# EAGLE design Custrom_Rhino_Board (EAGLE 6.5.0)
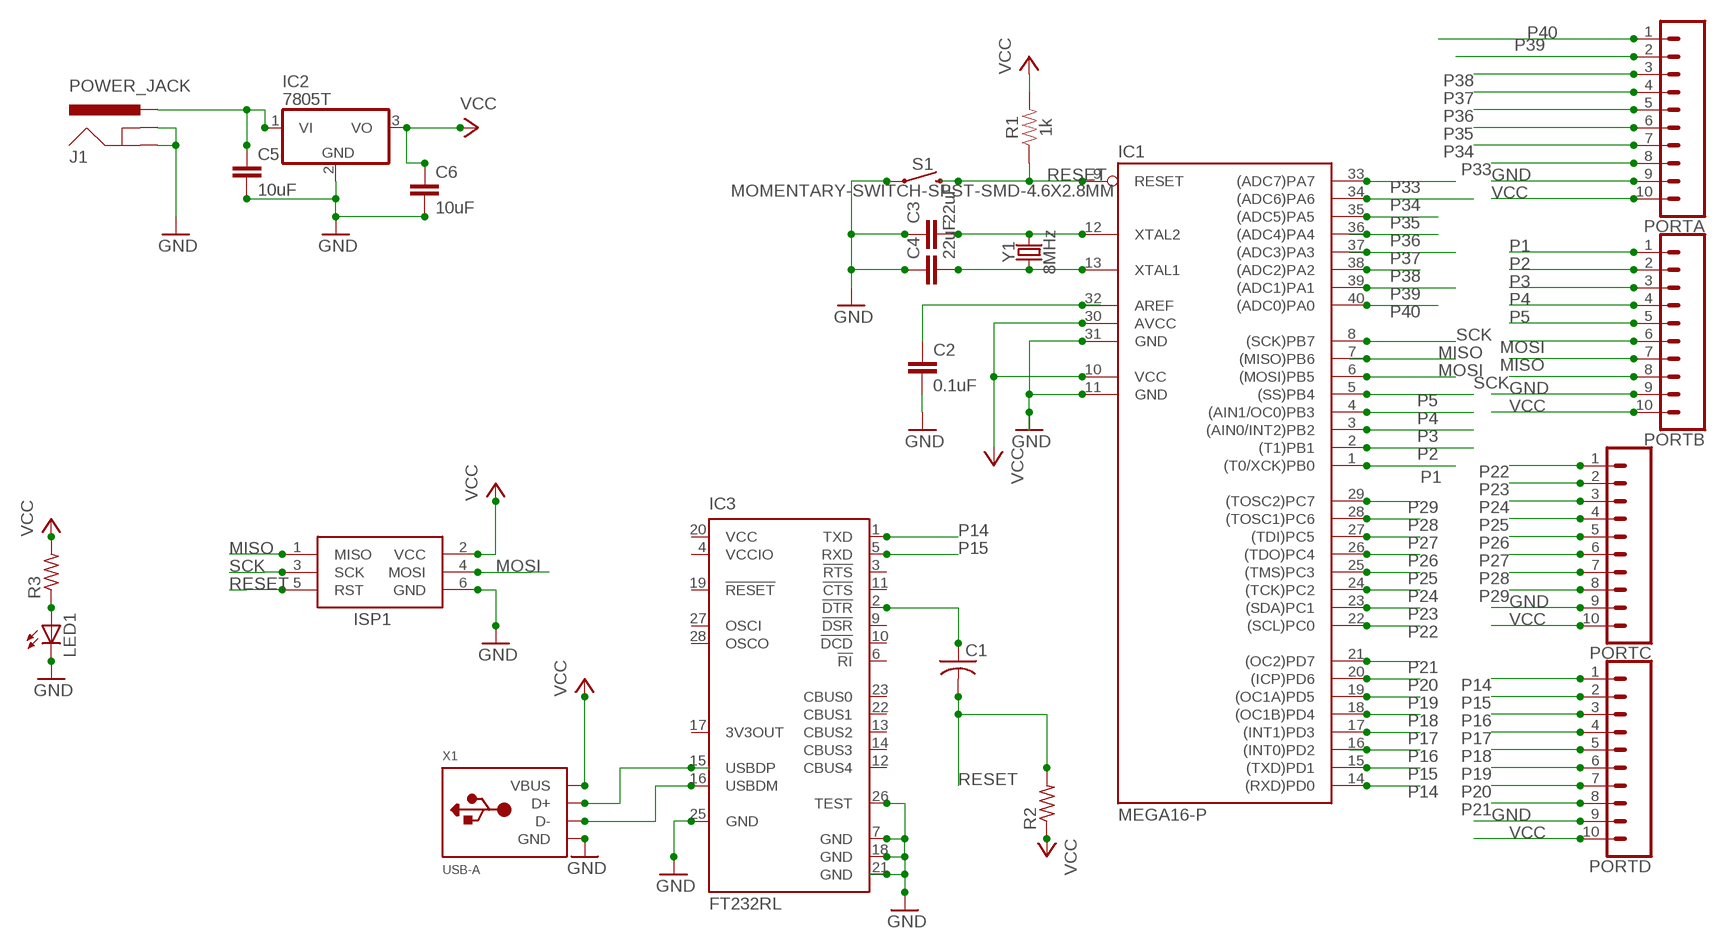
[diagram p0: schematic, sheet 1]

## Parts
C1  C-US025-024X044  [C025-024X044]
C2  0.1uF  0.1UF-0603-100V-10%  [0603]
C3  22uF  22UF-0805-6.3V-20%  [0805]
C4  22uF  22UF-0805-6.3V-20%  [0805]
C5  10uF  10UF-0805-10V-10%  [0805]
C6  10uF  10UF-0805-10V-10%  [0805]
IC1  MEGA16-P  [DIL40]
IC2  7805T  [TO220H]
IC3  FT232RL  [SSOP28]
ISP1  AVRISP-6  [AVRISP]
J1  POWER_JACK  [POWER_JACK_PTH]
LED1  LEDCHIP-LED0603  [CHIP-LED0603]
PORTA  CONN_10"  [1X10]
PORTB  CONN_10"  [1X10]
PORTC  CONN_10"  [1X10]
PORTD  CONN_10"  [1X10]
R1  1k  1KOHM-HORIZ-1/4W-1%  [AXIAL-0.3]
R2  R-US_0204/5  [0204/5]
R3  R-US_0204/5  [0204/5]
S1  MOMENTARY-SWITCH-SPST-SMD-4.6X2.8MM  [TACTILE_SWITCH_SMD_4.6X2.8MM]
X1  USB-A  [MOLEX_480371000]
Y1  8MHz  CRYSTAL-8MHZSMD-HC49UP  [HC49UP]

## Nets
GND: C2.2 C3.1 C4.1 C5.2 C6.2 IC1.11(GND) IC1.31(GND) IC2.2(GND) IC3.7(GND) IC3.18(GND) IC3.21(GND) IC3.25(GND) IC3.26(TEST) ISP1.6(GND) J1.GND J1.GNDBREAK LED1.C PORTA.9 PORTB.9 PORTC.9 PORTD.9 S1.1 S1.2 X1.4(GND)
MISO: IC1.7((MISO)PB6) ISP1.1(MISO) PORTB.7
MOSI: IC1.6((MOSI)PB5) ISP1.4(MOSI) PORTB.6
N$1: C2.1 IC1.32(AREF)
N$2: C1.1 IC3.2(!DTR)
N$3: C3.2 IC1.12(XTAL2) Y1.2
N$4: C4.2 IC1.13(XTAL1) Y1.1
N$15: C5.1 IC2.1(VI) J1.PWR
N$16: IC3.15(USBDP) X1.3(D+)
N$17: IC3.16(USBDM) X1.2(D-)
N$18: LED1.A R3.1
P1: IC1.1((T0/XCK)PB0) PORTB.1
P2: IC1.2((T1)PB1) PORTB.2
P3: IC1.3((AIN0/INT2)PB2) PORTB.3
P4: IC1.4((AIN1/OC0)PB3) PORTB.4
P5: IC1.5((SS)PB4) PORTB.5
P14: IC1.14((RXD)PD0) IC3.1(TXD) PORTD.1
P15: IC1.15((TXD)PD1) IC3.5(RXD) PORTD.2
P16: IC1.16((INT0)PD2) PORTD.3
P17: IC1.17((INT1)PD3) PORTD.4
P18: IC1.18((OC1B)PD4) PORTD.5
P19: IC1.19((OC1A)PD5) PORTD.6
P20: IC1.20((ICP)PD6) PORTD.7
P21: IC1.21((OC2)PD7) PORTD.8
P22: IC1.22((SCL)PC0) PORTC.1
P23: IC1.23((SDA)PC1) PORTC.2
P24: IC1.24((TCK)PC2) PORTC.3
P25: IC1.25((TMS)PC3) PORTC.4
P26: IC1.26((TDO)PC4) PORTC.5
P27: IC1.27((TDI)PC5) PORTC.6
P28: IC1.28((TOSC1)PC6) PORTC.7
P29: IC1.29((TOSC2)PC7) PORTC.8
P33: IC1.33((ADC7)PA7) PORTA.8
P34: IC1.34((ADC6)PA6) PORTA.7
P35: IC1.35((ADC5)PA5) PORTA.6
P36: IC1.36((ADC4)PA4) PORTA.5
P37: IC1.37((ADC3)PA3) PORTA.4
P38: IC1.38((ADC2)PA2) PORTA.3
P39: IC1.39((ADC1)PA1) PORTA.2
P40: IC1.40((ADC0)PA0) PORTA.1
RESET: C1.2 IC1.9(RESET) ISP1.5(RST) R1.P$1 R2.2 S1.3 S1.4
SCK: IC1.8((SCK)PB7) ISP1.3(SCK) PORTB.8
VCC: C6.1 IC1.10(VCC) IC1.30(AVCC) IC2.3(VO) ISP1.2(VCC) PORTA.10 PORTB.10 PORTC.10 PORTD.10 R1.P$2 R2.1 R3.2 X1.1(VBUS)
Unconnected: IC3.3(!RTS) IC3.6(!RI) IC3.9(!DSR) IC3.10(!DCD) IC3.11(!CTS) IC3.12(CBUS4) IC3.13(CBUS2) IC3.14(CBUS3) IC3.17(3V3OUT) IC3.19(!RESET) IC3.22(CBUS1) IC3.23(CBUS0) IC3.27(OSCI) IC3.28(OSCO)

## Power pins joined to a net without a drawn wire
VCC: IC3.20(VCC)
VCCIO: IC3.4(VCCIO)

## Library data of the parts
C1 = adafruit:C-US: CAPACITOR, American symbol
C2 = SparkFun-Capacitors:0.1UF: 0.1µF ceramic capacitors A capacitor is a passive two-terminal electrical component used to store electrical energy temporarily in an electric field.; PROD_ID: CAP-08390
C3 C4 = SparkFun-Capacitors:22UF: 22µF ceramic capacitors A capacitor is a passive two-terminal electrical component used to store electrical energy temporarily in an electric field.; PROD_ID: CAP-08402
C5 C6 = SparkFun-Capacitors:10UF: 10.0µF ceramic capacitors A capacitor is a passive two-terminal electrical component used to store electrical energy temporarily in an electric field.; PROD_ID: CAP-11330
IC1 = atmel:MEGA16-P: MICROCONTROLLER 16 Kbytes FLASH 1 kbytes SRAM 512 bytes EEPROM USART 8-channel 10 bit ADC Source: avr.lbr; MPN: ATMEGA16-16PU; OC_FARNELL: 9171142; OC_NEWARK: 01M6885
IC2 = adafruit:78*: Positive VOLTAGE REGULATOR Added bigger pads to the TO-92 package
IC3 = ftdichip:FT232R: Source: http://www.ftdichip.com/Documents/DataSheets/DS_FT232R_v104.pdf; MPN: FT232RL; OC_FARNELL: 1146032; OC_NEWARK: 91K9918
ISP1 = adafruit:AVRISP: AVR ISP HEADER Standard 6 pin header for AVR programming
J1 = SparkFun-Connectors:POWER_JACK: Power Jack Connector This is the standard 5.5mm barrel jack for power. The PTH is the most common, proven, reliable, footprint. The Slot footprint only works if the mill layer is transmitted to the PCB fab house so be warned. Here are the connectors we sell at SparkFun: DC Barrel Power Jack/Connector <https://www.sparkfun.com/products/119> (PRT-00119) DC Barrel Power Jack/Connector (SMD) <https://www.sparkfun.com/products/12748> (PRT-12748) DC Barrel Jack Adapter - Breadboard Compatible <https://www.sparkfun.com/products/10811> (PRT-10811) It is used on this SparkFun product (and many, many others): SparkFun RedBoard - Programmed with Arduino <https://www.sparkfun.com/products/12757> (DEV-12757) Also, if you need a mating power supply or connector, please check these out: Wall Adapter Power Supply - 9VDC 650mA <https://www.sparkfun.com/products/298> (TOL-00298) DC Barrel Jack Adapter - Male <https://www.sparkfun.com/products/10287> (PRT-10287); PROD_ID: CONN-08197
LED1 = adafruit:LED: LED OSRAM: - CHIPLED LG R971, LG N971, LY N971, LG Q971, LY Q971, LO R971, LY R971 LH N974, LH R974 LS Q976, LO Q976, LY Q976 LO Q996 - Hyper CHIPLED LW Q18S LB Q993, LB Q99A, LB R99A - SideLED LS A670, LO A670, LY A670, LG A670, LP A670 LB A673, LV A673, LT A673, LW A673 LH A674 LY A675 LS A676, LA A676, LO A676, LY A676, LW A676 LS A679, LY A679, LG A679 - Hyper Micro SIDELED® LS Y876, LA Y876, LO Y876, LY Y876 LT Y87S - SmartLED LW L88C, LW L88S LB L89C, LB L89S, LG L890 LS L89K, LO L89K, LY L89K LS L896, LA L896, LO L896, LY L896 - TOPLED LS T670, LO T670, LY T670, LG T670, LP T670 LSG T670, LSP T670, LSY T670, LOP T670, LYG T670 LG T671, LOG T671, LSG T671 LB T673, LV T673, LT T673, LW T673 LH T674 LS T676, LA T676, LO T676, LY T676, LB T676, LH T676, LSB T676, LW T676 LB T67C, LV T67C, LT T67C, LS T67K, LO T67K, LY T67K, LW E67C LS E67B, LA E67B, LO E67B, LY E67B, LB E67C, LV E67C, LT E67C LW T67C LS T679, LY T679, LG T679 LS T770, LO T770, LY T770, LG T770, LP T770 LB T773, LV T773, LT T773, LW T773 LH T774 LS E675, LA E675, LY E675, LS T675 LS T776, LA T776, LO T776, LY T776, LB T776 LHGB T686 LT T68C, LB T68C - Hyper Mini TOPLED® LB M676 - Mini TOPLED Santana® LG M470 LS M47K, LO M47K, LY M47K Source: http://www.osram.convergy.de/
PORTA PORTB PORTC PORTD = SparkFun-Connectors:CONN_10: Multi connection point. Often used as Generic Header-pin footprint for 0.1 inch spaced/style header connections On any of the 0.1 inch spaced packages, you can populate with these: Break Away Headers - Straight <https://www.sparkfun.com/products/116> (PRT-00116) Break Away Male Headers - Right Angle <https://www.sparkfun.com/products/553> (PRT-00553) Female Headers <https://www.sparkfun.com/products/115> (PRT-00115) Break Away Headers - Machine Pin <https://www.sparkfun.com/products/117> (PRT-00117) Break Away Female Headers - Swiss Machine Pin <https://www.sparkfun.com/products/743> (PRT-00743) Arduino Stackable Header - 10 Pin <https://www.sparkfun.com/products/11376> (PRT-11376) For SCREWTERMINALS and SPRING TERMINALS visit here: Screw Terimnals on SparkFun.com <https://www.sparkfun.com/search/results?term=Screw+Terminals> (5mm/3.5mm/2.54mm spacing) This device is also useful as a general connection point to wire up your design to another part of your project. Our various solder wires solder well into these plated through hole pads. Hook-Up Wire - Assortment (Stranded, 22 AWG) <https://www.sparkfun.com/products/11375> (PRT-11375) Hook-Up Wire - Assortment (Solid Core, 22 AWG) <https://www.sparkfun.com/products/11367> (PRT-11367) View the entire wire category on our website here <https://www.sparkfun.com/categories/141> Special notes: Molex polarized connector foot print use with SKU : PRT-08231 with associated crimp pins and housings. 1MM SMD Version SKU: PRT-10208 NOTES ON THE VARIANTS LOCK and LOCK_LONGPADS... This footprint was designed to help hold the alignment of a through-hole component (i.e. 6-pin header) while soldering it into place. You may notice that each hole has been shifted either up or down by 0.005 of an inch from it's more standard position (which is a perfectly straight line). This slight alteration caused the pins (the squares in the middle) to touch the edges of the holes. Because they are alternating, it causes a "brace" to hold the component in place. 0.005 has proven to be the perfect amount of "off-center" position when using our standard breakaway headers. Although looks a little odd when you look at the bare footprint, once you have a header in there, the alteration is very hard to notice. Also,if you push a header all the way into place, it is covered up entirely on the bottom side.; PROD_ID: CONN-11563
R1 = SparkFun-Resistors:1KOHM: 1kΩ resistor A resistor is a passive two-terminal electrical component that implements electrical resistance as a circuit element. Resistors act to reduce current flow, and, at the same time, act to lower voltage levels within circuits. - Wikipedia; PROD_ID: RES-12182
R2 R3 = adafruit:R-US_: RESISTOR, American symbol
S1 = SparkFun-Switches:MOMENTARY-SWITCH-SPST: Momentary Switch (Pushbutton) - SPST Normally-open (NO) SPST momentary switches (buttons, pushbuttons). Variants PTH-12MM - 12mm square, through-hole Momentary Pushbutton Switch - 12mm Square <https://www.sparkfun.com/products/9190> (COM-09190) PTH-6.0MM, PTH-6.0MM-KIT - 6.0mm square, through-hole Mini Pushbutton Switch <https://www.sparkfun.com/products/97> (COM-00097) KIT package intended for soldering kit's - only one side of pads' copper is exposed. PTH-RIGHT-ANGLE-KIT - Right-angle, through-hole Right Angle Tactile Button <https://www.sparkfun.com/products/10791> - Used on SparkFun BigTime Watch Kit <https://www.sparkfun.com/products/11734> SMD-12MM - 12mm square, surface-mount Tactile Button - SMD (12mm) <https://www.sparkfun.com/products/12993> (COM-12993) Used on SparkFun PicoBoard <https://www.sparkfun.com/products/11888> SMD-4.5MM - 4.5mm Square Trackball Switch Used on SparkFun Blackberry Trackballer Breakout <https://www.sparkfun.com/products/13169> SMD-4.6MMX2.8MM - 4.60mm x 2.80mm, surface mount Used on SparkFun SAMD21 Mini Breakout <https://www.sparkfun.com/products/13664> SMD-5.2MM, SMD-5.2-REDUNDANT - 5.2mm square, surface-mount Mini Pushbutton Switch - SMD <https://www.sparkfun.com/products/8720> (COM-08720) Used on Arduino Pro Mini <https://www.sparkfun.com/products/11114> REDUNDANT package connects both switch circuits together SMD-6.0X3.5MM - 6.0 x 3.5mm, surface mount Momentary Reset Switch SMD <https://www.sparkfun.com/products/8229> (COM-08229) SMD-6.2MM-TALL - 6.2mm square, surface mount Tactile Button - SMD (6mm) <https://www.sparkfun.com/products/12992> Used on SparkFun Digital Sandbox <https://www.sparkfun.com/products/12651> SMD-RIGHT-ANGLE - Right-angle, surface mount Used on SparkFun Block for Intel® Edison - Arduino <https://www.sparkfun.com/products/13036>; PROD_ID: SWCH-13065
X1 = adafruit:USB-A: USB type A 'plug' Used for things that can directly connect to a USB port, say USB key
Y1 = SparkFun-Clocks:CRYSTAL-8MHZ: 8MHz Crystal Datasheet Example <http://www.futureelectronics.com/en/technologies/electromechanical/timing-devices/crystals/Pages/6008189-ABM3B-8.000MHZ-B2-T.aspx?IM=0> Frequency: 8MHz Frequency Tolerance: ±20ppm Load Capacitance: 18pF SparkFun Products: Pro Micro -3.3V/8MHz <https://www.sparkfun.com/products/12587> WAV Trigger <https://www.sparkfun.com/products/13660>; PROD_ID: XTAL-11706

## Board
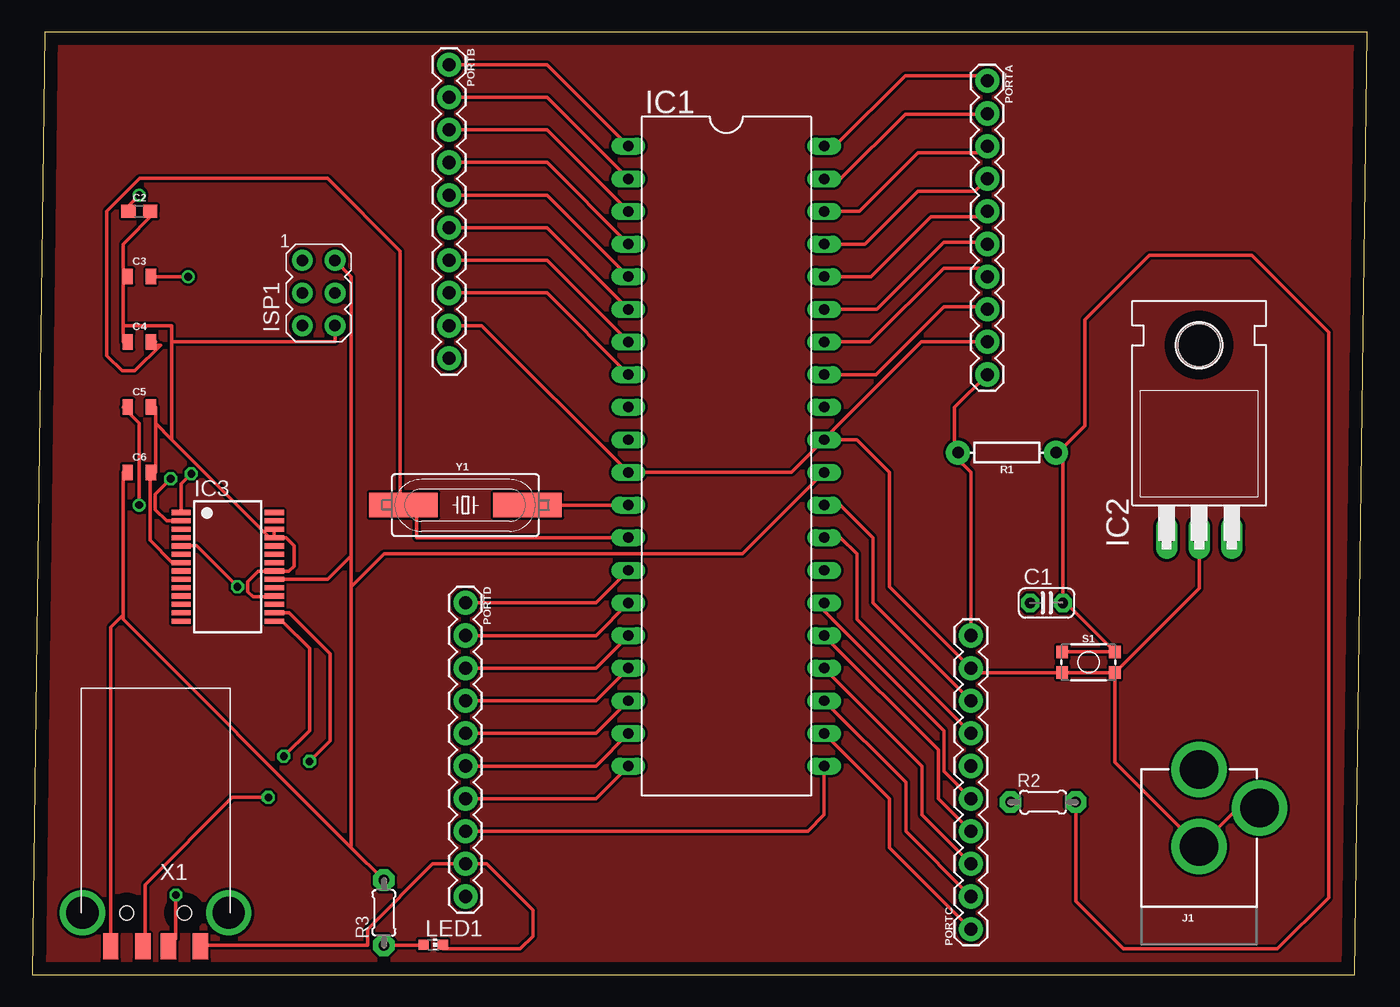
[diagram p1: board, top side]
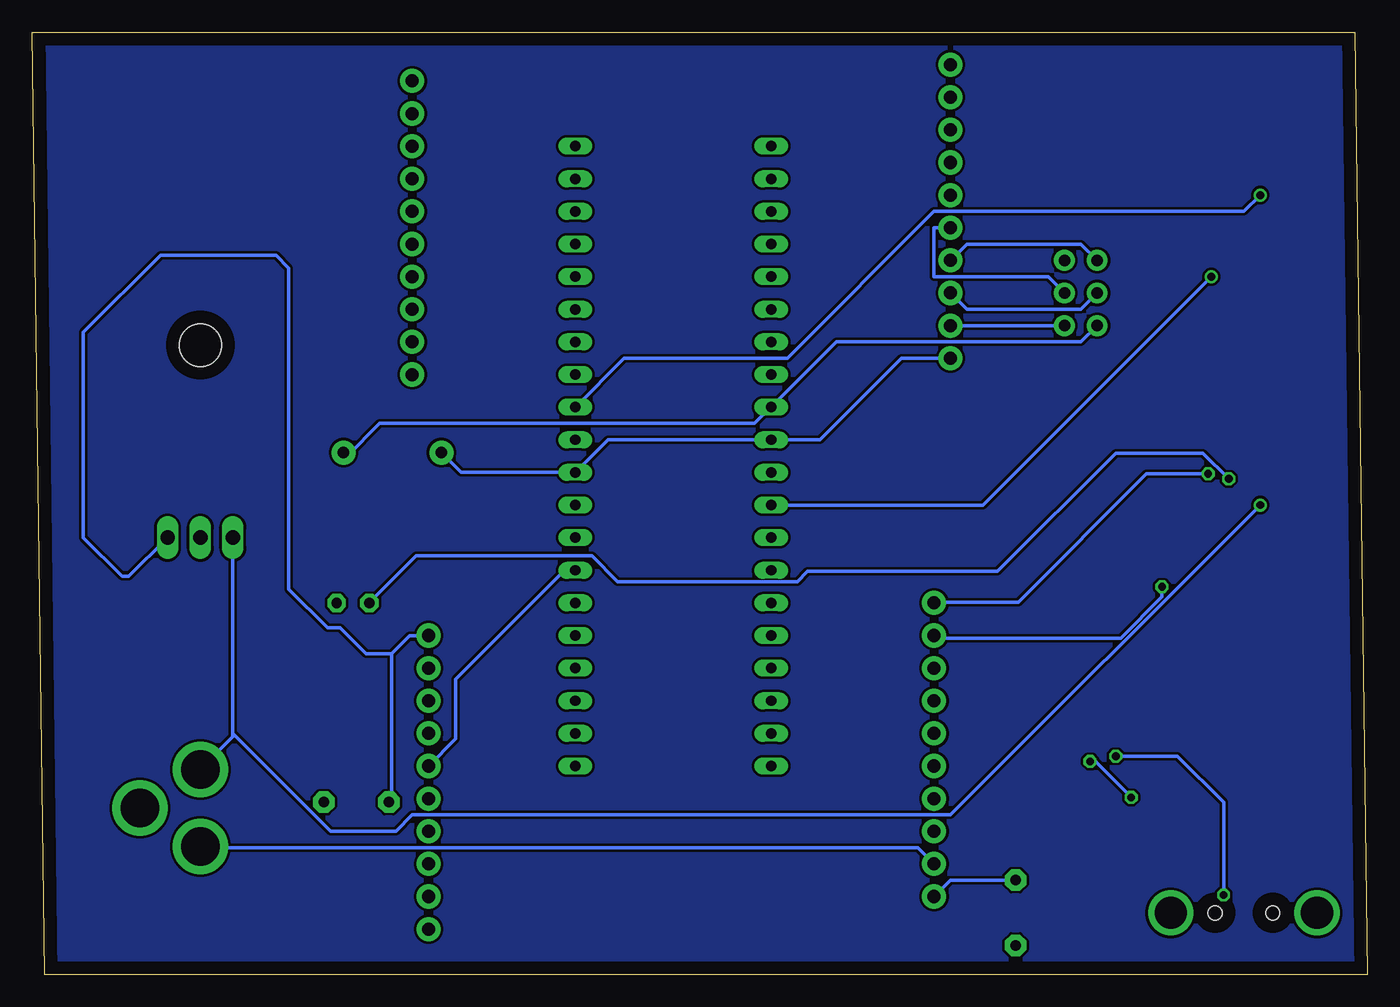
[diagram p2: board, bottom side, seen from below]

Size 104 x 73.38 mm. Coordinates in mm from the lower left corner, seen from the top.
Outline: 0,0 103,0 104,73.38 1,73.38 0,0
Copper layers (1*16): Top 0.035mm / dielectric 1.5mm / Bottom 0.035mm
Design rules "default": minimum track width 10mil, minimum drill 24mil, track to track 8mil, track to pad 8mil, pad to pad 8mil, via to via 8mil, smd to smd 8mil, copper to edge 40mil, drill to drill 8mil, minimum pad ring 10mil, minimum via ring 8mil, stop-mask expansion 4mil, vias tented up to drill 0mil, thermal gap 10mil

### Footprints (pad centres in the part's own frame; a part is rotated, then mirrored left to right if it is on the bottom)
C025-024X044 = drill 0.813 pad 1.422 octagon: 1 -1.27,0; 2 1.27,0
0603 = smd 1.1 x 1: 1 -0.85,0; 2 0.85,0
0805 = smd 0.8 x 1.2: 1 -0.9,0; 2 0.9,0
DIL40 = drill 0.813 long: 1 -24.13,-7.62; 2 -21.59,-7.62; 3 -19.05,-7.62; 4 -16.51,-7.62; 5 -13.97,-7.62; 6 -11.43,-7.62; 7 -8.89,-7.62; 8 -6.35,-7.62; 9 -3.81,-7.62; 10 -1.27,-7.62; 11 1.27,-7.62; 12 3.81,-7.62; 13 6.35,-7.62; 14 8.89,-7.62; 15 11.43,-7.62; 16 13.97,-7.62; 17 16.51,-7.62; 18 19.05,-7.62; 19 21.59,-7.62; 20 24.13,-7.62; 21 24.13,7.62; 22 21.59,7.62; 23 19.05,7.62; 24 16.51,7.62; 25 13.97,7.62; 26 11.43,7.62; 27 8.89,7.62; 28 6.35,7.62; 29 3.81,7.62; 30 1.27,7.62; 31 -1.27,7.62; 32 -3.81,7.62; 33 -6.35,7.62; 34 -8.89,7.62; 35 -11.43,7.62; 36 -13.97,7.62; 37 -16.51,7.62; 38 -19.05,7.62; 39 -21.59,7.62; 40 -24.13,7.62
TO220H = drill 1.118 long: 1 -2.54,-10.16; 2 0,-10.16; 3 2.54,-10.16 | hole 3.302: 0,4.826
SSOP28 = smd 0.4 x 1.5: 1 -4.225,-3.625; 2 -3.575,-3.625; 3 -2.925,-3.625; 4 -2.275,-3.625; 5 -1.625,-3.625; 6 -0.975,-3.625; 7 -0.325,-3.625; 8 0.325,-3.625; 9 0.975,-3.625; 10 1.625,-3.625; 11 2.275,-3.625; 12 2.925,-3.625; 13 3.575,-3.625; 14 4.225,-3.625; 15 4.225,3.625; 16 3.575,3.625; 17 2.925,3.625; 18 2.275,3.625; 19 1.625,3.625; 20 0.975,3.625; 21 0.325,3.625; 22 -0.325,3.625; 23 -0.975,3.625; 24 -1.625,3.625; 25 -2.275,3.625; 26 -2.925,3.625; 27 -3.575,3.625; 28 -4.225,3.625
AVRISP = drill 0.9 pad 1.626: 1 -1.27,2.54; 2 1.27,2.54; 3 -1.27,0; 4 1.27,0; 5 -1.27,-2.54; 6 1.27,-2.54
POWER_JACK_PTH = drill 2.997 pad 4.318: GND 0,7.7; GNDBREAK 4.7,10.7; PWR 0,13.7
CHIP-LED0603 = smd 0.8 x 0.8: A 0,-0.75; C 0,0.75
1X10 = drill 1.016 pad 1.88: 1 0,0; 2 2.54,0; 3 5.08,0; 4 7.62,0; 5 10.16,0; 6 12.7,0; 7 15.24,0; 8 17.78,0; 9 20.32,0; 10 22.86,0
AXIAL-0.3 = drill 0.9 pad 1.88: P$1 -3.81,0; P$2 3.81,0
0204/5 = drill 0.813 pad 1.676 octagon: 1 -2.54,0; 2 2.54,0
TACTILE_SWITCH_SMD_4.6X2.8MM = smd 0.9 x 1: 1 -2.05,-0.8; 2 2.05,-0.8; 3 2.05,0.8; 4 -2.05,0.8
MOLEX_480371000 = smd 1.2 x 2: 1 3.5,2.6; 2 1,2.6; 3 -1,2.6; 4 -3.5,2.6 | drill 2.5: M1 -5.7,0; M2 5.7,0 | hole 1.1: -2.25,0; 2.25,0
HC49UP = smd 5.334 x 1.93: 1 -4.826,0; 2 4.826,0

### Placement (x,y rotation side)
C1  79.01,28.94 0 top
C2  8.35,59.42 0 top
C3  8.35,54.34 0 top
C4  8.35,49.26 0 top
C5  8.35,44.18 0 top
C6  8.35,39.1 0 top
IC1  54.07,40.37 270 top
IC2  90.9,44.18 0 top
IC3  15.24,31.75 270 top
ISP1  22.32,53.07 0 top
J1  90.9,2.27 0 top
LED1  31.24,2.33 270 top
PORTA  74.39,69.58 270 top
PORTB  32.48,70.85 270 top
PORTC  73.12,3.54 90 top
PORTD  33.75,28.94 270 top
R1  75.93,40.64 180 top
R2  78.74,13.43 0 top
R3  27.4,4.81 90 top
S1  82.28,24.32 0 top
X1  9.62,4.81 180 top
Y1  33.75,36.56 0 top

### Tracks (layer width: path | path; a pad name or v marks a point on that pad's centre or on a via)
GND
  Top 0.254: PORTB.9 35.02,50.53 IC1.11 59.15,39.1 IC1.31 | IC1.31 64.23,41.64 66.77,39.1 66.77,30.21 PORTC.9 73.46,23.52 S1.1 S1.2 | PORTA.9 69.26,49.26 62,42 62,41.95 IC1.31 | J1.GNDBREAK 93.9,12.97 J1.GND 84.33,16.54 S1.2 | IC2.2 90.9,30.09 S1.2 | 7.08,54.34 7.08,56.88 9.62,59.42 C2.2 | 7.08,54.34 7.08,50.53 | 7.08,50.53 7.08,49.26 C4.1 | 7.08,54.34 C3.1 | 9.62,42.91 9.62,44.18 C5.2 | 9.62,42.91 9.62,39.1 C6.2 9.2,39.05 9.2,33.8 10.93,32.08 IC3.7 | 9.62,42.91 10.89,41.64 | 10.89,41.64 18.51,34.02 IC3.25 | 7.08,50.53 10.89,50.53 10.89,49.26 | 10.89,41.64 10.89,49.26 | X1.4 13.43,2.27 26.13,2.27 26.13,3.54 31.21,8.62 PORTD.9 35.38,8.62 39,5 39,3 38,2 32,2 LED1.C | 10.89,49.26 23.59,49.26 ISP1.6 | IC3.26 IC3.25 | IC3.25 19.77,34.02 20.4,33.4 20.4,31.8 20,31.4 18.89,31.4 | 18.89,31.4 IC3.21 | 18.89,31.4 17.6,31.4 16.8,30.6 16.8,29.8 17.2,29.4 18.79,29.4 IC3.18
  Bottom 0.254: PORTB.9 ISP1.6 | PORTD.9 35.02,9.89 90.9,9.89 J1.GND
MISO
  Top 0.254: PORTB.7 40.1,55.61 IC1.7
  Bottom 0.254: ISP1.1 22.32,56.88 31.21,56.88 PORTB.7
MOSI
  Top 0.254: PORTB.6 40.1,58.15 IC1.6
  Bottom 0.254: ISP1.4 24.86,54.34 33.75,54.34 33.75,58.15 PORTB.6
N$1  (via drill 0.61)
  Top 0.254: v8.35,60.69 7.08,59.42 C2.1
  Bottom 0.254: v8.35,60.69 9.62,59.42 33.75,59.42 45.18,47.99 57.88,47.99 IC1.32
N$2  (via drill 0.6)
  Top 0.254: IC3.2 10.47,35.33 9.6,36.2 9.6,37.4 v10.8,38.6
  Bottom 0.254: v10.8,38.6 12.8,40.6 19.6,40.6 28.8,31.4 43.6,31.4 44.4,30.6 58.4,30.6 60.4,32.6 74.08,32.6 C1.1
N$3  (via drill 0.61)
  Top 0.254: v12.16,54.34 C3.2 | IC1.12 Y1.2
  Bottom 0.254: v12.16,54.34 29.94,36.56 IC1.12
N$4
  Top 0.254: 9.62,49.26 C4.2 9.51,49 10,49 8,47 7,47 5.81,48.19 5.81,59.42 8.39,62 23,62 28.67,56.33 28.67,36.56 Y1.1 29.94,36.56 29.94,34.02 IC1.13
N$5
  pour Bottom: 1,73 1,0 103,0 103,5 103,74 1,74
N$6
  pour Top: 1,74 1,0 103,0 103,2 103,74
N$15  (via drill 0.61)
  Top 0.254: v8.35,36.56 8.35,42.91 7.08,44.18 C5.1
  Bottom 0.254: IC2.1 88.36,18.78 | 88.36,18.78 88.36,18.51 J1.PWR | v8.35,36.56 32.48,12.43 74.39,12.43 75.66,11.16 80.74,11.16 88.36,18.78
N$16  (via drill 0.6)
  Top 0.254: IC3.15 19.48,27.52 21.6,25.4 21.6,19 v19.6,17 | v11.2,6.2 11.2,2.79 X1.3
  Bottom 0.254: v19.6,17 14.8,17 11.2,13.4 v11.2,6.2
N$17  (via drill 0.6)
  Top 0.254: IC3.16 20.02,28.18 23.2,25 23.2,18.2 v21.6,16.6 | v18.4,13.8 15.6,13.8 8.8,7 8.8,2.39 X1.2
  Bottom 0.254: v21.6,16.6 21.2,16.6 v18.4,13.8
N$18
  Top 0.254: R3.1 30.43,2.27 LED1.A
P1
  Top 0.254: PORTB.1 40.1,70.85 IC1.1
P2
  Top 0.254: PORTB.2 40.1,68.31 IC1.2
P3
  Top 0.254: PORTB.3 40.1,65.77 IC1.3
P4
  Top 0.254: PORTB.4 40.1,63.23 IC1.4
P5
  Top 0.254: PORTB.5 40.1,60.69 IC1.5
P14  (via drill 0.6)
  Top 0.254: PORTD.1 43.91,28.94 IC1.14 | IC3.1 11.62,38.22 v12.4,39
  Bottom 0.254: v12.4,39 17.2,39 27.2,29 34.34,29 34.4,28.94 PORTD.1
P15  (via drill 0.6)
  Top 0.254: PORTD.2 43.91,26.4 IC1.15 | IC3.5 12.82,33.38 v16,30.2
  Bottom 0.254: v16,30.2 16,29.4 19.2,26.2 33.55,26.2 PORTD.2
P16
  Top 0.254: PORTD.3 43.91,23.86 IC1.16
P17
  Top 0.254: PORTD.4 43.91,21.32 IC1.17
P18
  Top 0.254: PORTD.5 43.91,18.78 IC1.18
P19
  Top 0.254: PORTD.6 43.91,16.24 IC1.19
P20
  Top 0.254: PORTD.7 43.91,13.7 IC1.20
P21
  Top 0.254: PORTD.8 60.42,11.16 61.69,12.43 IC1.21
P22
  Top 0.254: IC1.22 66.77,13.7 66.77,9.89 PORTC.1
P23
  Top 0.254: IC1.23 68.04,14.97 68.04,11.16 PORTC.2
P24
  Top 0.254: IC1.24 69.31,16.24 69.31,12.43 PORTC.3
P25
  Top 0.254: IC1.25 70.58,17.51 70.58,13.7 PORTC.4
P26
  Top 0.254: IC1.26 61.69,28.31 71,19 71,15.82 PORTC.5
P27
  Bottom 0.254: IC1.27 62.52,31.48 71,23 71,18.36 PORTC.6
P28
  Top 0.254: IC1.28 62.96,34.02 64.23,32.75 64.23,27.67 PORTC.7
P29
  Top 0.254: IC1.29 62.96,36.56 65.5,34.02 65.5,28.94 PORTC.8
P33
  Top 0.254: IC1.33 65.72,46.72 71,52 74.19,52 PORTA.8
P34
  Top 0.254: IC1.34 65.26,49.26 71,55 73.73,55 PORTA.7
P35
  Top 0.254: IC1.35 65.8,51.8 71,57 74.27,57 PORTA.6
P36
  Top 0.254: IC1.36 65.34,54.34 70,59 73.97,59 PORTA.5
P37
  Top 0.254: IC1.37 64.88,56.88 69,61 73.43,61 PORTA.4
P38
  Top 0.254: IC1.38 64.42,59.42 69,64 73.89,64 PORTA.3
P39
  Top 0.254: IC1.39 62.96,61.96 68,67 74.39,67 | 74.39,67 75,67 | PORTA.2 74.39,67
P40
  Top 0.254: IC1.40 62.5,64.5 68,70 73.97,70 PORTA.1
RESET
  Top 0.254: S1.4 S1.3 80.51,28.94 C1.2 80.28,41 | 80.28,41 80.28,41.18 R1.P$1 | R2.2 81.28,5.72 85,2 97,2 101,6 101,50 95,56 87,56 82,51 82,42.72 80.28,41
  Bottom 0.254: ISP1.5 22.32,49.26 41.37,49.26 IC1.9 47.72,42.91 76.93,42.91 79.47,40.37 R1.P$1
SCK
  Top 0.254: PORTB.8 40.1,53.07 IC1.8
  Bottom 0.254: ISP1.3 22.32,51.8 31.21,51.8 PORTB.8
VCC
  Top 0.254: PORTA.10 71.85,44.18 71.85,40.37 | 71.85,40.37 73.12,39.1 PORTC.10 | 71.85,40.37 R1.P$2 | 7.08,28 7.08,27.67 24.86,9.89 | 7.08,28 7.08,39.1 C6.1 | R3.2 24.86,9.89 | ISP1.2 24.86,54.34 24.86,32.6 | 24.86,9.89 24.86,30.2 | 24.86,30.2 24.86,32.6 | IC1.30 55.34,32.75 27.41,32.75 24.86,30.2 | X1.1 6.12,27.04 7.08,28 | IC3.20 23.04,30.77 24.86,32.6
  Bottom 0.254: PORTB.10 36.29,47.99 42.64,41.64 IC1.10 59.15,41.64 IC1.30 70.58,39.1 R1.P$2 | PORTC.10 74.6,26.4 76,25 | 76,25 76,13.63 R2.1 | 76,25 78,25 80,27 81,27 84,30 84,55 85,56 94,56 100,50 100,34 97,31 96.46,31 IC2.3 | PORTD.10 32.48,7.35 R3.2